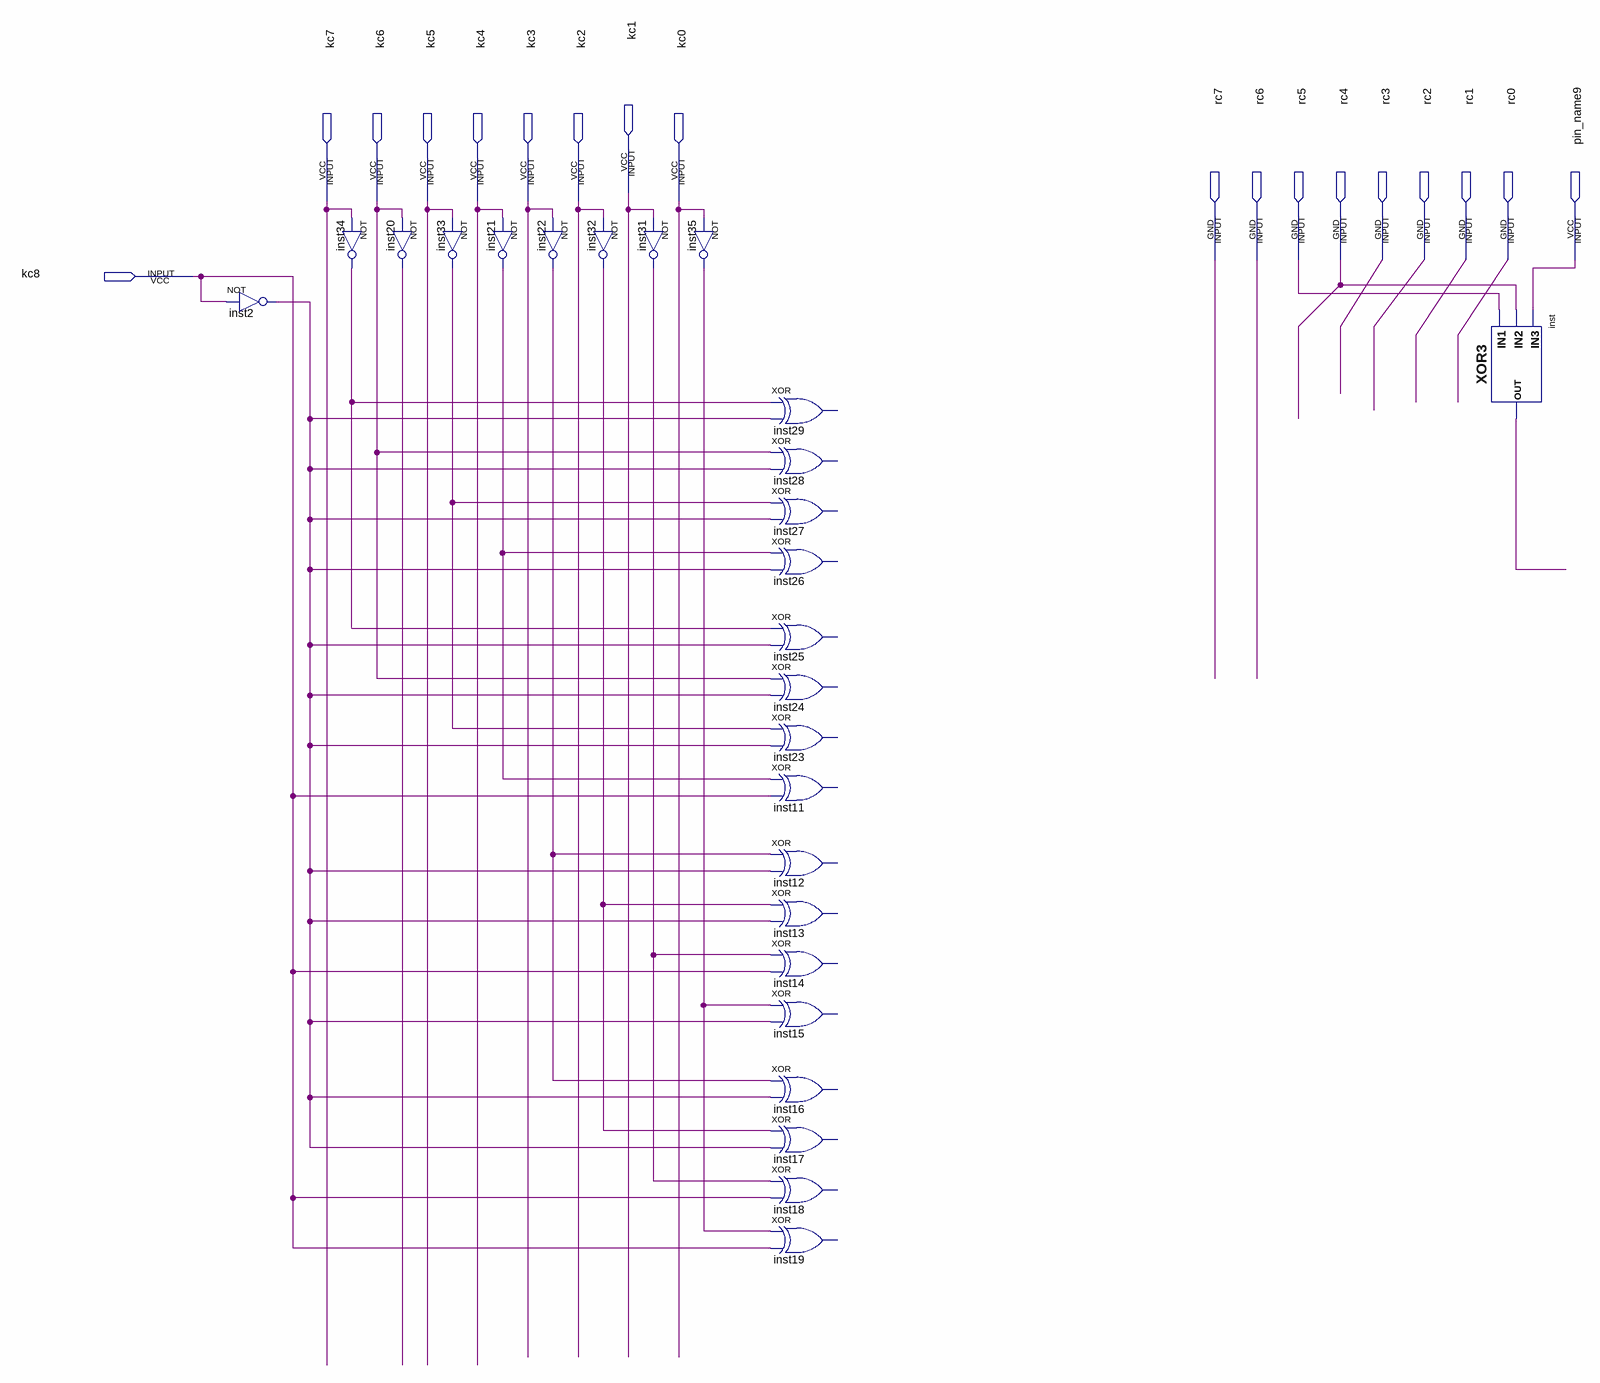
[diagram p0: schematic sheet]
// Quartus schematic LED.bdf as structural Verilog: 26 symbols, 18 pins
module LED (
  input  kc1,
  input  kc7,
  input  kc6,
  input  kc5,
  input  kc4,
  input  kc3,
  input  kc2,
  input  kc0,
  input  rc7,
  input  rc6,
  input  rc5,
  input  rc4,
  input  rc3,
  input  rc2,
  input  rc1,
  input  rc0,
  input  pin_name9,
  input  kc8
);

  wire inst2_out, inst20_out, inst21_out, inst22_out, inst31_out, inst32_out, inst33_out, inst34_out,
       inst35_out, inst_out;

  not inst2 (inst2_out, kc8);
  not inst34 (inst34_out, kc7);
  not inst20 (inst20_out, kc6);
  not inst33 (inst33_out, kc5);
  not inst21 (inst21_out, kc4);
  not inst22 (inst22_out, kc3);
  not inst31 (inst31_out, kc1);
  not inst32 (inst32_out, kc2);
  not inst35 (inst35_out, kc0);
  // XOR inst29 has open pins: IN1=inst34_out, IN2=inst2_out, OUT=open
  // XOR inst28 has open pins: IN1=kc6, IN2=inst2_out, OUT=open
  // XOR inst27 has open pins: IN1=inst33_out, IN2=inst2_out, OUT=open
  // XOR inst26 has open pins: IN1=inst21_out, IN2=inst2_out, OUT=open
  // XOR inst25 has open pins: IN1=inst34_out, IN2=inst2_out, OUT=open
  // XOR inst24 has open pins: IN1=kc6, IN2=inst2_out, OUT=open
  // XOR inst23 has open pins: IN1=inst33_out, IN2=inst2_out, OUT=open
  // XOR inst11 has open pins: IN1=inst21_out, IN2=kc8, OUT=open
  // XOR inst12 has open pins: IN1=inst22_out, IN2=inst2_out, OUT=open
  // XOR inst13 has open pins: IN1=inst32_out, IN2=inst2_out, OUT=open
  // XOR inst14 has open pins: IN1=inst31_out, IN2=kc8, OUT=open
  // XOR inst15 has open pins: IN1=inst35_out, IN2=inst2_out, OUT=open
  // XOR inst16 has open pins: IN1=inst22_out, IN2=inst2_out, OUT=open
  // XOR inst17 has open pins: IN1=inst32_out, IN2=inst2_out, OUT=open
  // XOR inst18 has open pins: IN1=inst31_out, IN2=kc8, OUT=open
  // XOR inst19 has open pins: IN1=inst35_out, IN2=kc8, OUT=open
  XOR3 inst (.IN3(pin_name9), .IN1(rc5), .IN2(rc4), .OUT(inst_out));
endmodule
